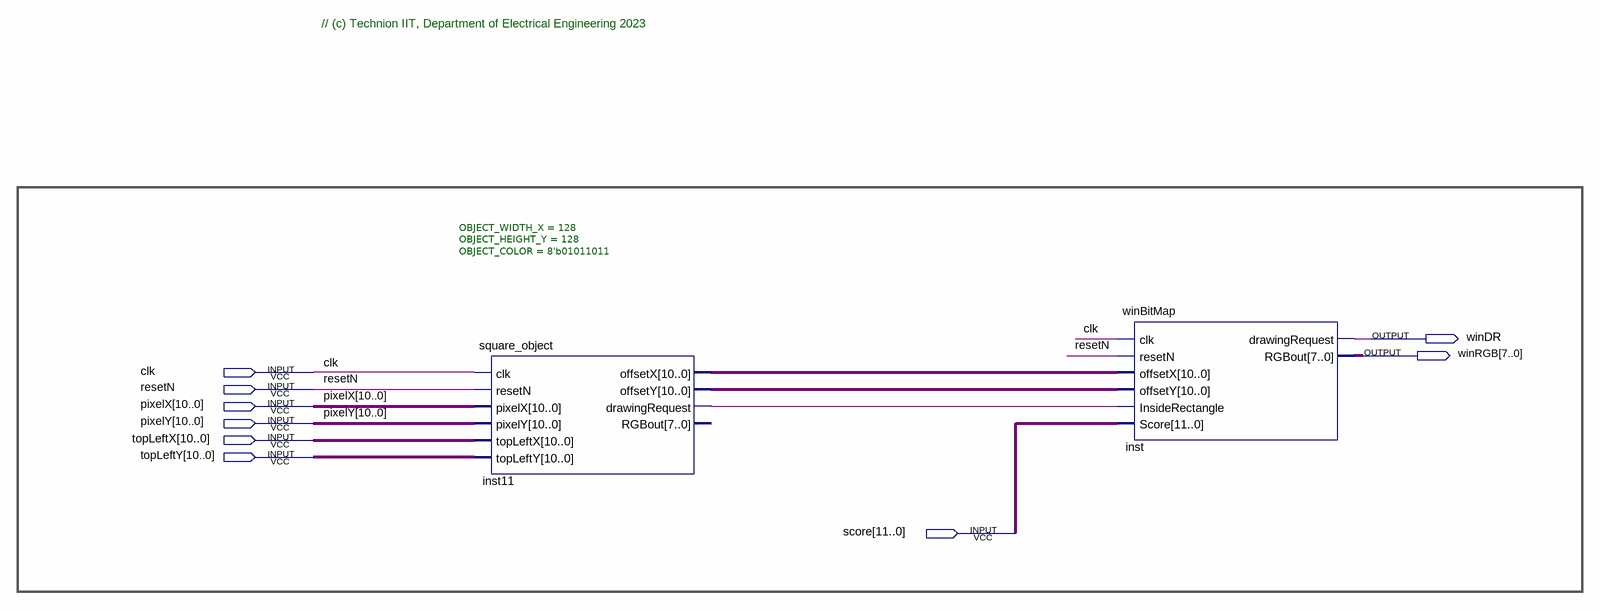
[diagram p0: schematic sheet]
// Quartus schematic WIN_DISPLAY.bdf as structural Verilog: 2 symbols, 9 pins
module WIN_DISPLAY (
  input  clk,
  input  resetN,
  input  [10:0] pixelX,
  input  [10:0] pixelY,
  input  [10:0] topLeftX,
  input  [10:0] topLeftY,
  input  [11:0] score,
  output winDR,
  output [7:0] winRGB
);

  wire inst11_drawingrequest;
  wire [10:0] inst11_offsetx, inst11_offsety;

  square_object #(.OBJECT_WIDTH_X(128), .OBJECT_HEIGHT_Y(128), .OBJECT_COLOR(8'b01011011)) inst11 (
    .clk(clk), .resetN(resetN), .pixelX(pixelX), .pixelY(pixelY), .topLeftX(topLeftX), .topLeftY(topLeftY),
    .offsetX(inst11_offsetx), .offsetY(inst11_offsety), .drawingRequest(inst11_drawingrequest));  // open: RGBout
  winBitMap inst (
    .clk(clk), .resetN(resetN), .offsetX(inst11_offsetx), .offsetY(inst11_offsety),
    .InsideRectangle(inst11_drawingrequest), .Score(score), .drawingRequest(winDR), .RGBout(winRGB));

  // Notes on the sheet:
  //   // (c) Technion IIT, Department of Electrical Engineering 2023
endmodule
